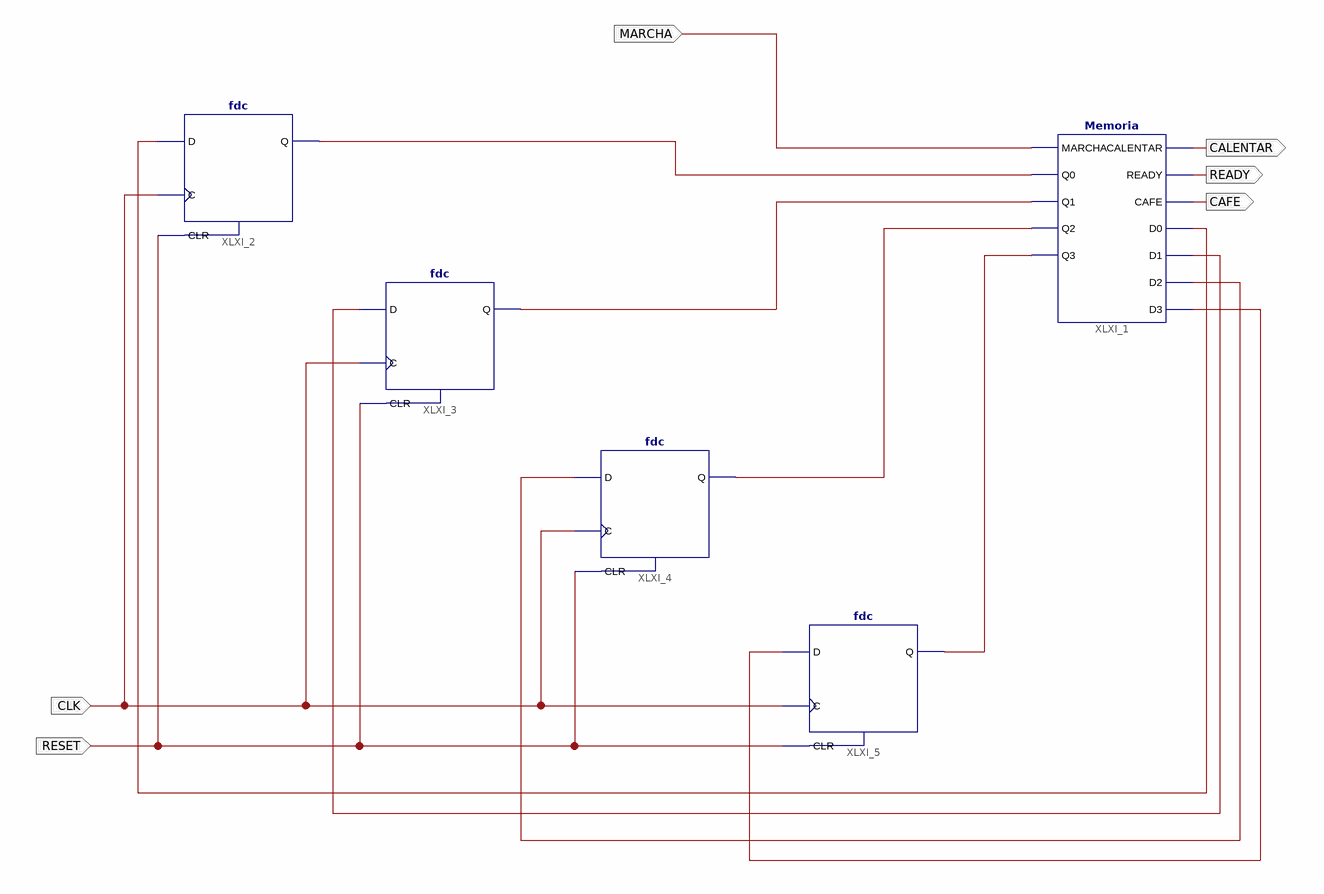
[diagram p0: schematic sheet 1]
// Xilinx ISE schematic p4ej3.sch (spartan3) as structural Verilog: 5 symbols, 6 ports
module p4ej3 (
  input  CLK,
  input  RESET,
  input  MARCHA,
  output CALENTAR,
  output READY,
  output CAFE
);

  wire XLXN_6, XLXN_7, XLXN_9, XLXN_10, XLXN_12, XLXN_13, XLXN_14, XLXN_15;

  Memoria XLXI_1 (
    .CAFE(CAFE), .CALENTAR(CALENTAR), .D0(XLXN_12), .D1(XLXN_13), .D2(XLXN_14), .D3(XLXN_15),
    .MARCHA(MARCHA), .Q0(XLXN_6), .Q1(XLXN_7), .Q2(XLXN_9), .Q3(XLXN_10), .READY(READY));
  fdc XLXI_2 (.C(CLK), .CLR(RESET), .D(XLXN_12), .Q(XLXN_6));
  fdc XLXI_3 (.C(CLK), .CLR(RESET), .D(XLXN_13), .Q(XLXN_7));
  fdc XLXI_4 (.C(CLK), .CLR(RESET), .D(XLXN_14), .Q(XLXN_9));
  fdc XLXI_5 (.C(CLK), .CLR(RESET), .D(XLXN_15), .Q(XLXN_10));
endmodule
